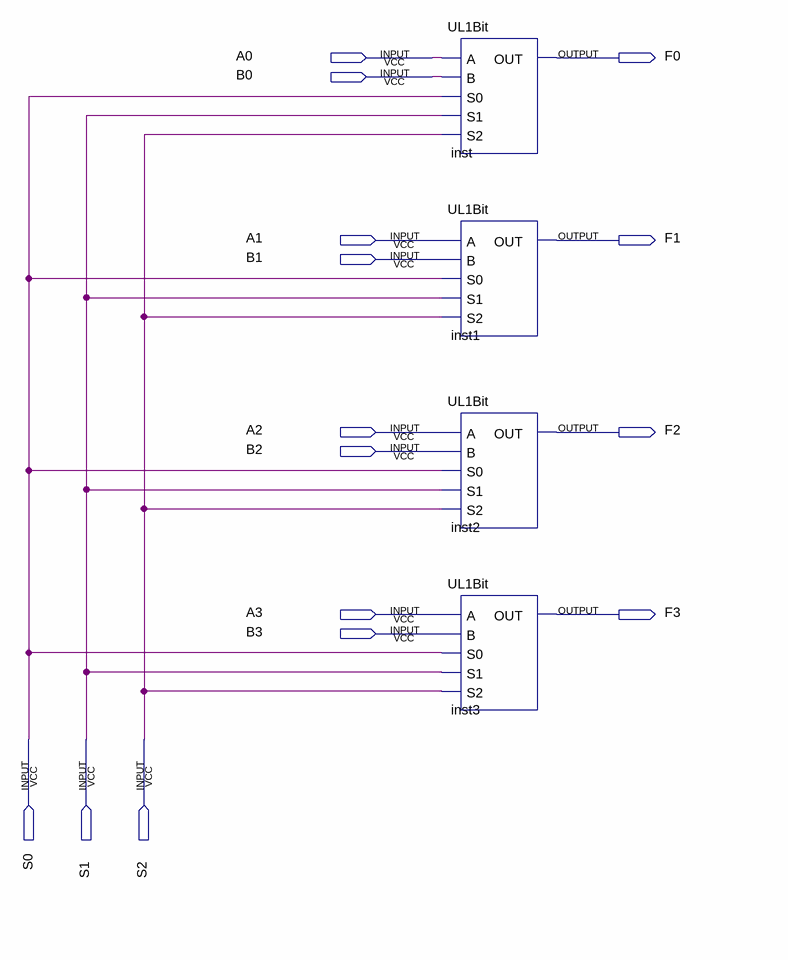
[diagram p0: schematic sheet]
// Quartus schematic UL4Bit.bdf as structural Verilog: 4 symbols, 15 pins
module UL4Bit (
  input  A0,
  input  B0,
  input  A1,
  input  B1,
  input  A2,
  input  B2,
  input  A3,
  input  B3,
  input  S0,
  input  S1,
  input  S2,
  output F0,
  output F1,
  output F2,
  output F3
);

  UL1Bit inst (.A(A0), .B(B0), .S0(S0), .S1(S1), .S2(S2), .OUT(F0));
  UL1Bit inst1 (.A(A1), .B(B1), .S0(S0), .S1(S1), .S2(S2), .OUT(F1));
  UL1Bit inst2 (.A(A2), .B(B2), .S0(S0), .S1(S1), .S2(S2), .OUT(F2));
  UL1Bit inst3 (.A(A3), .B(B3), .S0(S0), .S1(S1), .S2(S2), .OUT(F3));
endmodule
